# Altium schematic sheet ESP32-connectors&Battery.SchDoc: Connectors & Battery
size A4; Date: 9/11/2024; Author: Filip Kulka; DrawnBy: Filip Kulka; DocumentNumber: 2; Revision: 1.0; SheetNumber: 2; SheetTotal: 2; Desc: Auxilary connectors for any outside peripherals; BOM: ESP32_Board - Mobile Robot.BomDoc
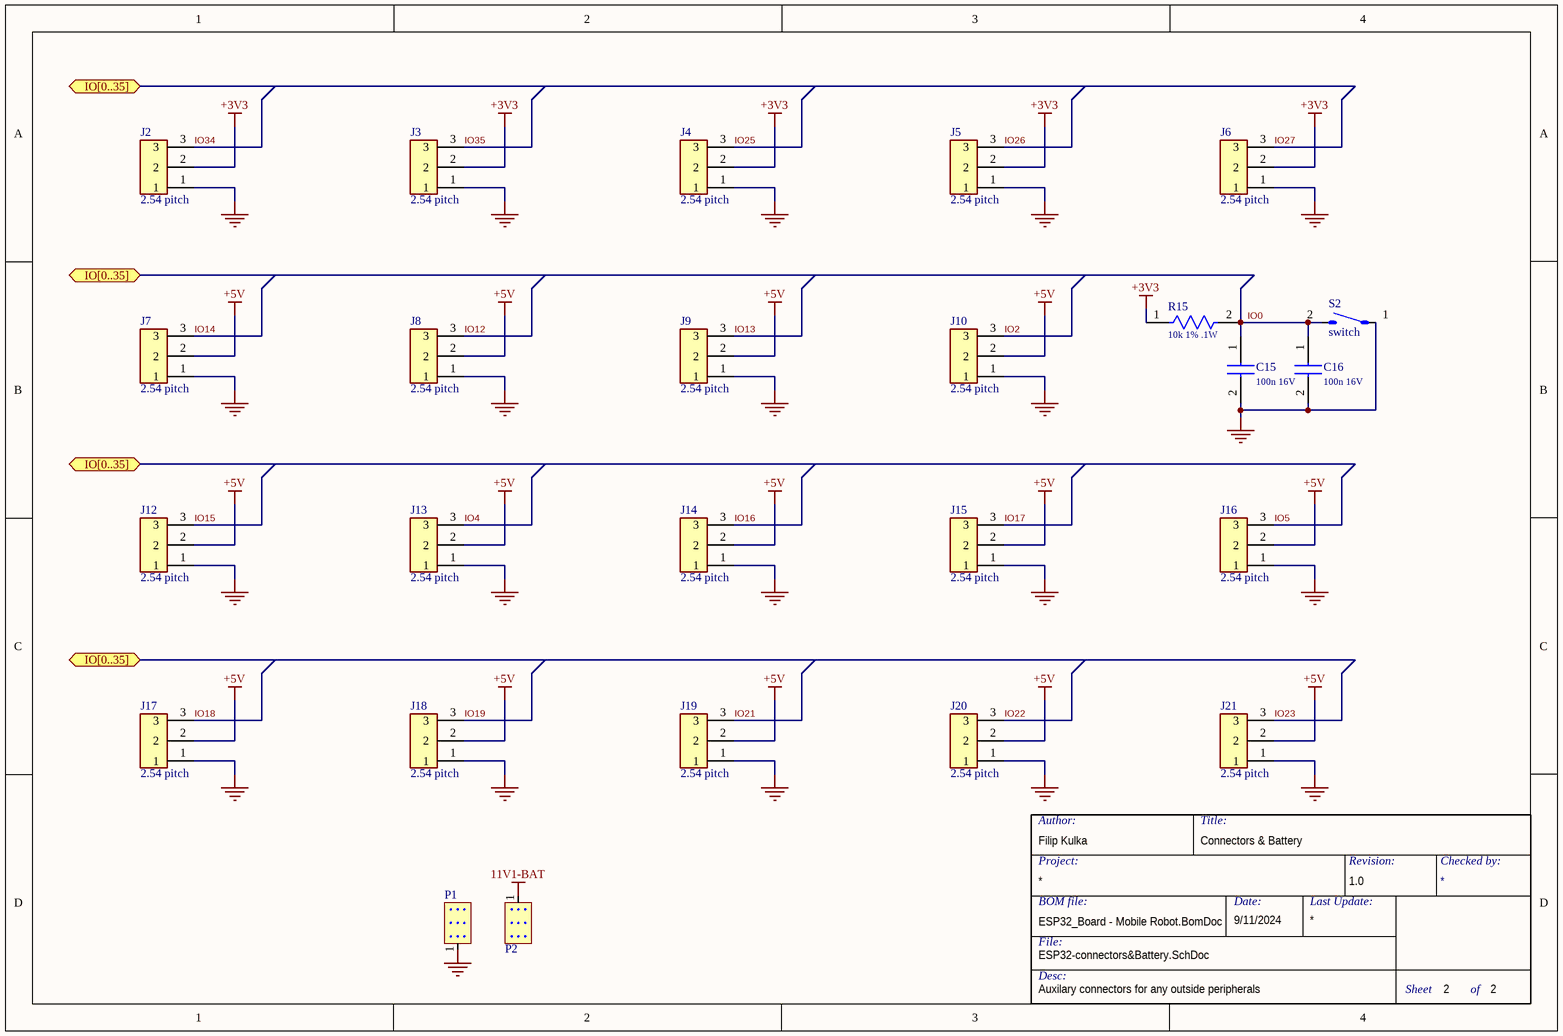
[diagram p0: ESP32-connectors&Battery.SchDoc]

## Parts
?  (no value)
C15  100n 16V  [CAPC1608X90N]
C16  100n 16V  [CAPC1608X90N]
J2  2.54 pitch  [HDRV3W64P0X254_1X3_762X250X952P]
J3  2.54 pitch  [HDRV3W64P0X254_1X3_762X250X952P]
J4  2.54 pitch  [HDRV3W64P0X254_1X3_762X250X952P]
J5  2.54 pitch  [HDRV3W64P0X254_1X3_762X250X952P]
J6  2.54 pitch  [HDRV3W64P0X254_1X3_762X250X952P]
J7  2.54 pitch  [HDRV3W64P0X254_1X3_762X250X952P]
J8  2.54 pitch  [HDRV3W64P0X254_1X3_762X250X952P]
J9  2.54 pitch  [HDRV3W64P0X254_1X3_762X250X952P]
J10  2.54 pitch  [HDRV3W64P0X254_1X3_762X250X952P]
J12  2.54 pitch  [HDRV3W64P0X254_1X3_762X250X952P]
J13  2.54 pitch  [HDRV3W64P0X254_1X3_762X250X952P]
J14  2.54 pitch  [HDRV3W64P0X254_1X3_762X250X952P]
J15  2.54 pitch  [HDRV3W64P0X254_1X3_762X250X952P]
J16  2.54 pitch  [HDRV3W64P0X254_1X3_762X250X952P]
J17  2.54 pitch  [HDRV3W64P0X254_1X3_762X250X952P]
J18  2.54 pitch  [HDRV3W64P0X254_1X3_762X250X952P]
J19  2.54 pitch  [HDRV3W64P0X254_1X3_762X250X952P]
J20  2.54 pitch  [HDRV3W64P0X254_1X3_762X250X952P]
J21  2.54 pitch  [HDRV3W64P0X254_1X3_762X250X952P]
P1  Battery pins with pad vias  [Battery Pad]  (value not drawn)
P2  Battery pins with pad vias  [Battery Pad]  (value not drawn)
R15  10k 1% .1W  [RESC1608X60N]
S2  switch  [434123025816]

## Ports
IO[0..35] (bidir, see ESP32-connectors&Battery[1A], ESP32-connectors&Battery[1B], ESP32-connectors&Battery[1C], ESP32_Schematic[3B]), IO[0..35] (bidir, see ESP32-connectors&Battery[1A], ESP32-connectors&Battery[1B], ESP32_Schematic[3B]), IO[0..35] (bidir, see ESP32-connectors&Battery[1B], ESP32-connectors&Battery[1C], ESP32_Schematic[3B])

## Nets
11V1-BAT: P2.1
+3V3: J2.2 J3.2 J4.2 J5.2 J6.2 R15.1
+5V: J7.2 J8.2 J9.2 J10.2 J12.2 J13.2 J14.2 J15.2 J16.2 J17.2 J18.2 J19.2 J20.2 J21.2
GND: C15.2 C16.2 J2.1 J3.1 J4.1 J5.1 J6.1 J7.1 J8.1 J9.1 J10.1 J12.1 J13.1 J14.1 J15.1 J16.1 J17.1 J18.1 J19.1 J20.1 J21.1 P1.1 S2.1(COM)
IO0: C15.1 C16.1 R15.2 S2.2(NO)
IO2: J10.3
IO4: J13.3
IO5: J16.3
IO12: J8.3
IO13: J9.3
IO14: J7.3
IO15: J12.3
IO16: J14.3
IO17: J15.3
IO18: J17.3
IO19: J18.3
IO21: J19.3
IO22: J20.3
IO23: J21.3
IO25: J4.3
IO26: J5.3
IO27: J6.3
IO34: J2.3
IO35: J3.3

## Notes on the sheet
- Author:
- Title:
- Project:
- BOM file:
- Date:
- Last Update:
- Revision:
- Checked by:
- File:
- Desc:
- Sheet
- of

## Library data of the parts
? = TitleBlock: This is a custom title block with my logo and a bit more info than the default one
C15 C16 = 0603YC104K4T4A: 100nF 0603 16V; Manufacturer_Name: Kyocera AVX; Datasheet Link: https://componentsearchengine.com/Datasheets/1/06031A100FAT2A.pdf; Height: 0.9mm; Manufacturer_Part_Number: 0603YC104K4T4A; Mouser Part Number: 581-0603YC104K4T4A; Mouser Price/Stock: https://www.mouser.co.uk/ProductDetail/KYOCERA-AVX/0603YC104K4T4A?qs=Cej1j9ztgjEkPqVJkA4Bng%3D%3D; Arrow Part Number: 0603YC104K4T4A; Arrow Price/Stock: https://www.arrow.com/en/products/0603yc104k4t4a/avx
J2-J10 J12-J21 = PH1-03-UA: Connector; Manufacturer_Name: Adam Tech; Datasheet Link: https://datasheet.datasheetarchive.com/originals/distributors/Datasheets_SAMA/34c52fbb4019bb4b288b881302863af3.pdf; Height: 9.516mm; Manufacturer_Part_Number: PH1-03-UA; Mouser Part Number: 737-PH1-03-UA; Mouser Price/Stock: https://www.mouser.co.uk/ProductDetail/Adam-Tech/PH1-03-UA?qs=HoCaDK9Nz5cktq3WKneQTQ%3D%3D; Arrow Part Number: PH1-03-UA; Arrow Price/Stock: https://www.arrow.com/en/products/ph1-03-ua/adam-tech?region=nac
P1 P2 = Battery Pad
R15 = CRT0603-FZ-1002ELF: 10k Resistor 1% 1/10W 0603; Manufacturer_Name: Bourns; Datasheet Link: https://componentsearchengine.com/Datasheets/1/CRT0603-FZ-1002ELF.pdf; Height: 0.6mm; Manufacturer_Part_Number: CRT0603-FZ-1002ELF; Mouser Part Number: 652-CRT0603FZ1002ELF; Mouser Price/Stock: https://www.mouser.com/Search/Refine.aspx?Keyword=652-CRT0603FZ1002ELF; Arrow Part Number: CRT0603-FZ-1002ELF; Arrow Price/Stock: https://www.arrow.com/en/products/crt0603-fz-1002elf/bourns
S2 = 434123025816: Manufacturer_Name: Wurth Elektronik; Datasheet Link: https://www.we-online.com/catalog/datasheet/434123025816.pdf; Height: 2.65mm; Manufacturer_Part_Number: 434123025816; Mouser Part Number: 710-434123025816; Mouser Price/Stock: https://www.mouser.co.uk/ProductDetail/Wurth-Elektronik/434123025816?qs=wr8lucFkNMVuWki%252Ba3C7oA%3D%3D